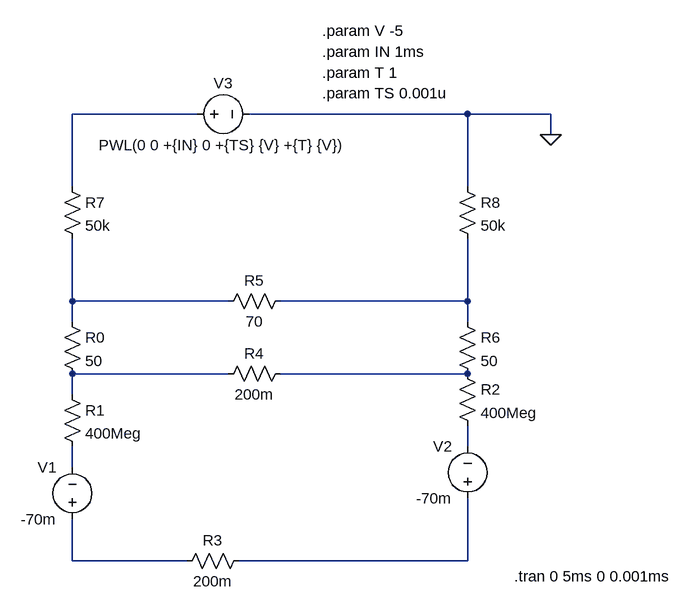
[diagram p0: schematic 電圧刺激等価回路_定常状態.asc]
電圧刺激等価回路_定常状態.asc, the LTspice schematic file:
Version 4
SHEET 1 1116 680
WIRE 320 -368 128 -368
WIRE 736 -368 400 -368
WIRE 864 -368 736 -368
WIRE 864 -336 864 -368
WIRE 128 -256 128 -368
WIRE 736 -256 736 -368
WIRE 128 -80 128 -176
WIRE 368 -80 128 -80
WIRE 736 -80 736 -176
WIRE 736 -80 448 -80
WIRE 128 -48 128 -80
WIRE 736 -48 736 -80
WIRE 368 32 128 32
WIRE 736 32 448 32
WIRE 128 64 128 32
WIRE 736 144 736 112
WIRE 128 176 128 144
WIRE 128 320 128 256
WIRE 304 320 128 320
WIRE 736 320 736 224
WIRE 736 320 384 320
FLAG 864 -336 0
SYMBOL voltage 304 -368 R270
WINDOW 0 32 56 VTop 2
WINDOW 3 -32 56 VBottom 2
WINDOW 123 0 0 Left 0
WINDOW 39 0 0 Left 0
SYMATTR InstName V3
SYMATTR Value PWL(0 0 +{IN} 0 +{TS} {V} +{T} {V})
SYMBOL res 112 48 R0
SYMATTR InstName R1
SYMATTR Value 400Meg
SYMBOL res 720 16 R0
SYMATTR InstName R2
SYMATTR Value 400Meg
SYMBOL res 400 304 R90
WINDOW 0 0 56 VBottom 2
WINDOW 3 32 56 VTop 2
SYMATTR InstName R3
SYMATTR Value 200m
SYMBOL res 112 -64 R0
SYMATTR InstName R0
SYMATTR Value 50
SYMBOL res 720 -64 R0
SYMATTR InstName R6
SYMATTR Value 50
SYMBOL res 112 -272 R0
SYMATTR InstName R7
SYMATTR Value 50k
SYMBOL res 720 -272 R0
SYMATTR InstName R8
SYMATTR Value 50k
SYMBOL voltage 128 272 R180
WINDOW 0 24 96 Left 2
WINDOW 3 24 16 Left 2
SYMATTR InstName V1
SYMATTR Value -70m
SYMBOL voltage 736 240 R180
WINDOW 0 24 96 Left 2
WINDOW 3 24 16 Left 2
SYMATTR InstName V2
SYMATTR Value -70m
SYMBOL res 464 16 R90
WINDOW 0 0 56 VBottom 2
WINDOW 3 32 56 VTop 2
SYMATTR InstName R4
SYMATTR Value 200m
SYMBOL res 464 -96 R90
WINDOW 0 0 56 VBottom 2
WINDOW 3 32 56 VTop 2
SYMATTR InstName R5
SYMATTR Value 70
TEXT 512 -496 Left 2 !.param V -5
TEXT 512 -464 Left 2 !.param IN 1ms
TEXT 512 -432 Left 2 !.param T 1
TEXT 808 344 Left 2 !.tran 0 5ms 0 0.001ms
TEXT 512 -400 Left 2 !.param TS 0.001u

The netlist it stands for:
* 電圧刺激等価回路_定常状態.asc
V3 N001 0 PWL(0 0 +{IN} 0 +{TS} {V} +{T} {V})
R1 N004 N007 400Meg
R2 N005 N006 400Meg
R3 N009 N008 200m
R0 N002 N004 50
R6 N003 N005 50
R7 N001 N002 50k
R8 0 N003 50k
V1 N008 N007 -70m
V2 N009 N006 -70m
R4 N005 N004 200m
R5 N003 N002 70
.param V -5
.param IN 1ms
.param T 1
.tran 0 5ms 0 0.001ms
.param TS 0.001u
.backanno
.end